# Altium schematic sheet Sch_USBSerie.SchDoc: Control de Domótica
size A4; Author: Francisco González González - Eugenia Ipar; CompanyName: Conexión USB y Puerto Serie; DocumentNumber: 10; SheetNumber: 10; SheetTotal: 12; Materia: Técnicas Digitales II; Placa: USB - USB a Puerto Serie; Year: 2015; Prof1: Prof: Alarcón, Juan; Prof2: Ayud: Crivelli, Marcelo; Prof3: Ayud: Montalti, Pablo; PageSetup: Record=PageOptions|CenterHorizontal=True|CenterVertical=True|PrintScale=1.00|XCorrection=1.00|YCorrection=1.00|PrintKind=0|BorderSize=5000000|LeftOffset=0|BottomOffset=0|Orientation=2|PaperLength=1000|PaperWidth=1000|Scale=100|PaperSource=7|PrintQuality=-3|MediaType=1|DitherType=10|PrintScaleMode=1|PaperKind=A4|PaperIndex=9
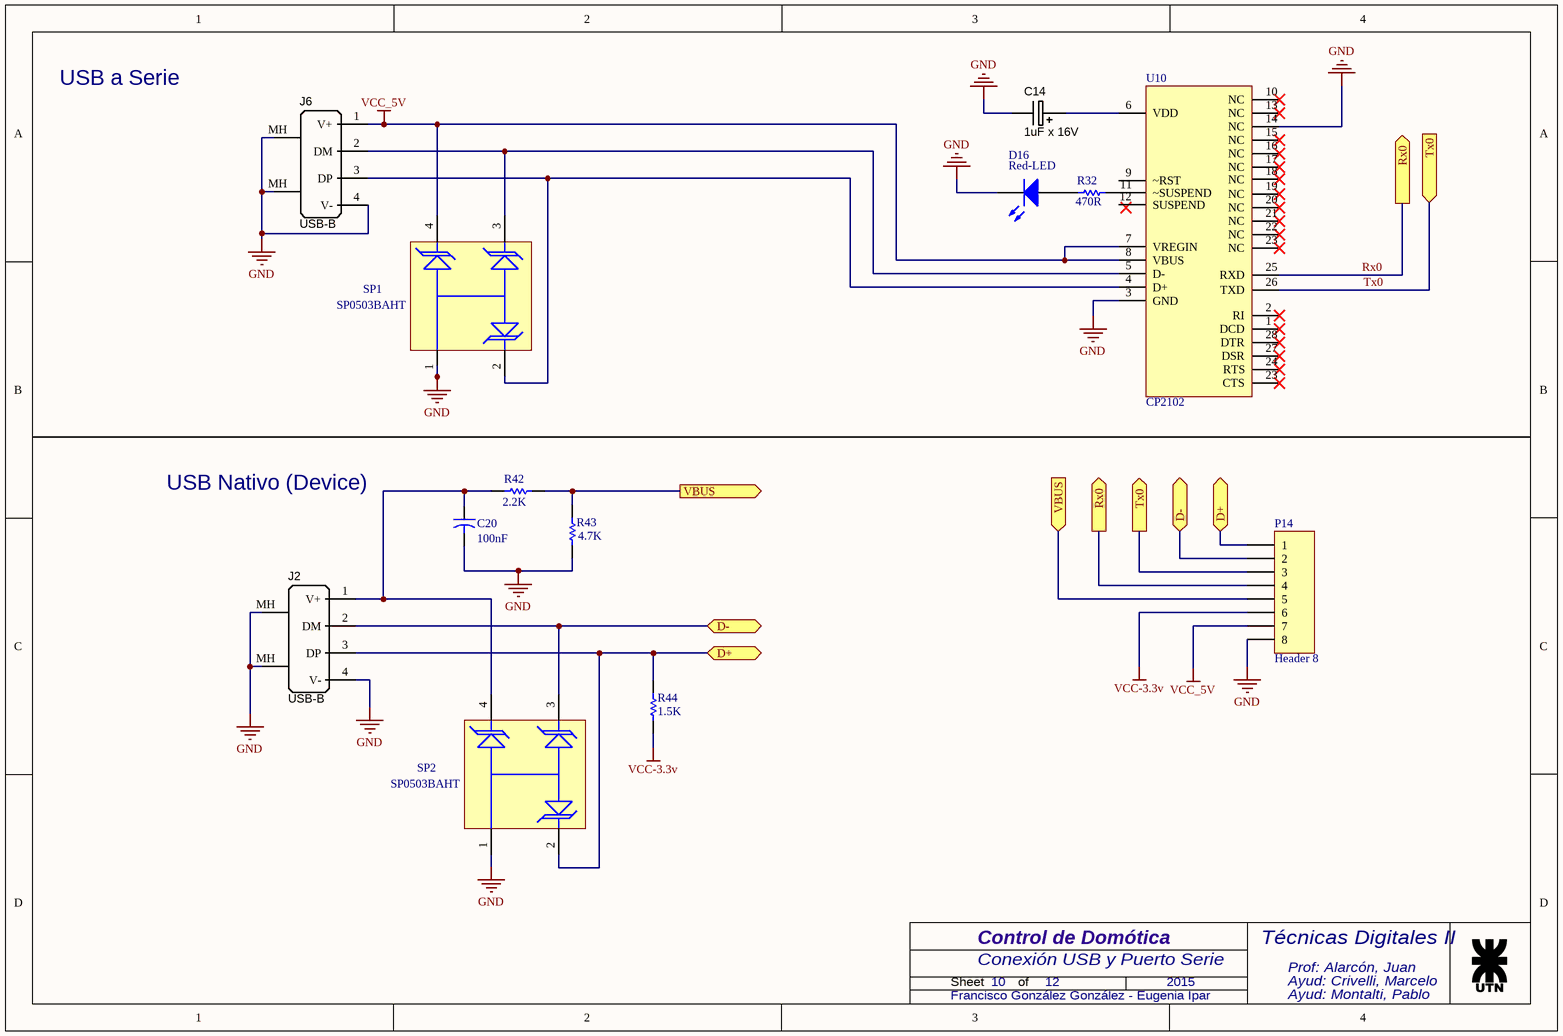
[diagram p0: Sch_USBSerie.SchDoc]

## Parts
C14  1uF x 16V  [CAPE3.5mm]
C20  value 100nF  [CAPR5-4X5]  (hidden comment: Cap2)
D16  Red-LED  [Type 3mm]
J2  USB-B  [USB_TypeB_Tyco]
J6  USB-B  [USB_TypeB_Tyco]
P14  Header 8  [HDR1X8]
R32  value 470R  [AXIAL-0.3]  (hidden comment: Res1)
R42  value 2.2K  [AXIAL-0.3]  (hidden comment: Res1)
R43  value 4.7K  [AXIAL-0.3]  (hidden comment: Res1)
R44  value 1.5K  [AXIAL-0.3]  (hidden comment: Res1)
SP1  SP0503BAHT  [SOT190P237X120-4N]
SP2  SP0503BAHT  [SOT190P237X120-4N]
U10  CP2102  [CP2102]

## Ports
D+ (bidir), D- (bidir), Rx0 (out), Tx0 (in), Tx0 (out), VBUS (in), VBUS (out)

## Nets
GND: C14.2 C20.2 D16.1(K) J2.4(V-) J2.MH(Shell) J6.4(V-) J6.MH(Shell) P14.8 R43.1 SP1.1 SP2.1 U10.3(GND) U10.14(NC)
VCC-3.3v: P14.6 R44.1
VCC_5V: J6.1(V+) P14.7 SP1.4 U10.7(VREGIN) U10.8(VBUS)
D+: J2.3(DP) P14.1 R44.2 SP2.2 ; port D+
D-: J2.2(DM) P14.2 SP2.3 ; port D-
Rx0: P14.4 U10.25(RXD) ; port Rx0
Tx0: P14.3 U10.26(TXD) ; port Tx0
VBUS: P14.5 R42.2 R43.2 ; port VBUS
NetC14_1: C14.1 U10.6(VDD)
NetC20_1: C20.1 J2.1(V+) R42.1 SP2.4
NetD16_2: D16.2(A) R32.1
NetJ6_2: J6.2(DM) SP1.3 U10.5(D-)
NetJ6_3: J6.3(DP) SP1.2 U10.4(D+)
NetR32_2: R32.2 U10.11(~SUSPEND)

Not connected (* = marked no-connect by the designer): U10 1(DCD)* 2(RI)* 9(~RST) 10(NC)* 12(SUSPEND) 13(NC)* 15(NC)* 16(NC)* 17(NC)* 18(NC)* 19(NC)* 20(NC)* 21(NC)* 22(NC)* 23(NC)* 24(RTS)* 27(DSR)* 28(DTR)*

## Notes on the sheet
- USB a Serie
- USB Nativo (Device)
- Sheet
- of

## Library data of the parts
C14 = CAPE_220u_16V_THD: Capacitor THT Alum Elec 220uF 20% 16V; Manufacturer 1: Nichicon; Manufacturer Part Number 1: UPW1C221MPD; Ratings: 16V; 80°C; Material: Al; SCDType: undef; Manufacturer 2: Zhuhai Gree Xinyuan Electric; Manufacturer Part Number 2: CD11C-220-16V; Package / Case: radial 8.0D x 7.0H x 3.5mm pitch; Tolerance: ±20%; Supplier 1: Digi-Key; Supplier Part Number 1: 493-1783-ND; Value: 1uF x 16V
C20 = Cap2: Capacitor; Published: 23-Sep-2002; PackageReference: CAPR5-4X5; Publisher: Altium Limited; PackageDescription: Capacitor; 2 Leads
D16 = CMP-1488-00002-1: THT LED round mono-color color lens, WL-TMRW, Super Red; PartNumber: 151031SS06000; Manufacturer: Wuerth Elektronik; ComponentLink2URL: http://katalog.we-online.de/pbs/datasheet/7448042001.pdfhttp://katalog.we-online.de/pbs/datasheet/7448042001.pdfhttp://katalog.we-online.de/pbs/datasheet/7448042001.pdfhttp://katalog.we-online.de/pbs/datasheet/151031SS06000.pdf; ComponentLink1URL: http://www.we-online.com; ComponentLink2Description: Datasheet; PackageReference: Type 3mm; Emitting color: Super Red; ComponentLink1Description: Manufacturer URL
J2 J6 = USB_TypeB: Connector THT Type B USB connector; Manufacturer Part Number 1: 292304-1; Manufacturer 1: TE Connectivity; Specifications: USB 2.0; SCDType: undef; Package / Case: R/A Type B; Supplier 1: Digi-Key; Connector Type: USB - B; Supplier Part Number 1: A31725-ND
P14 = Header 8: Header, 8-Pin; LatestRevisionDate: 17-Jul-2002; LatestRevisionNote: Re-released for DXP Platform.; Publisher: Altium Limited
R32 R42-R44 = Res1: Resistor; Published: 8-Jun-2000; LatestRevisionDate: 17-Jul-2002; LatestRevisionNote: Re-released for DXP Platform.; PackageReference: AXIAL-0.3; Publisher: Altium Limited; PackageDescription: Axial Device, Thru-Hole; 2 Leads; 0.3 in Pin Spacing
SP1 SP2 = Component_1: Diode Array 30pF 30kV
U10 = Component_1